# EAGLE schematic Modular_RFPA_v100 (EAGLE 6.6.0)

## Sheet 1 of 3
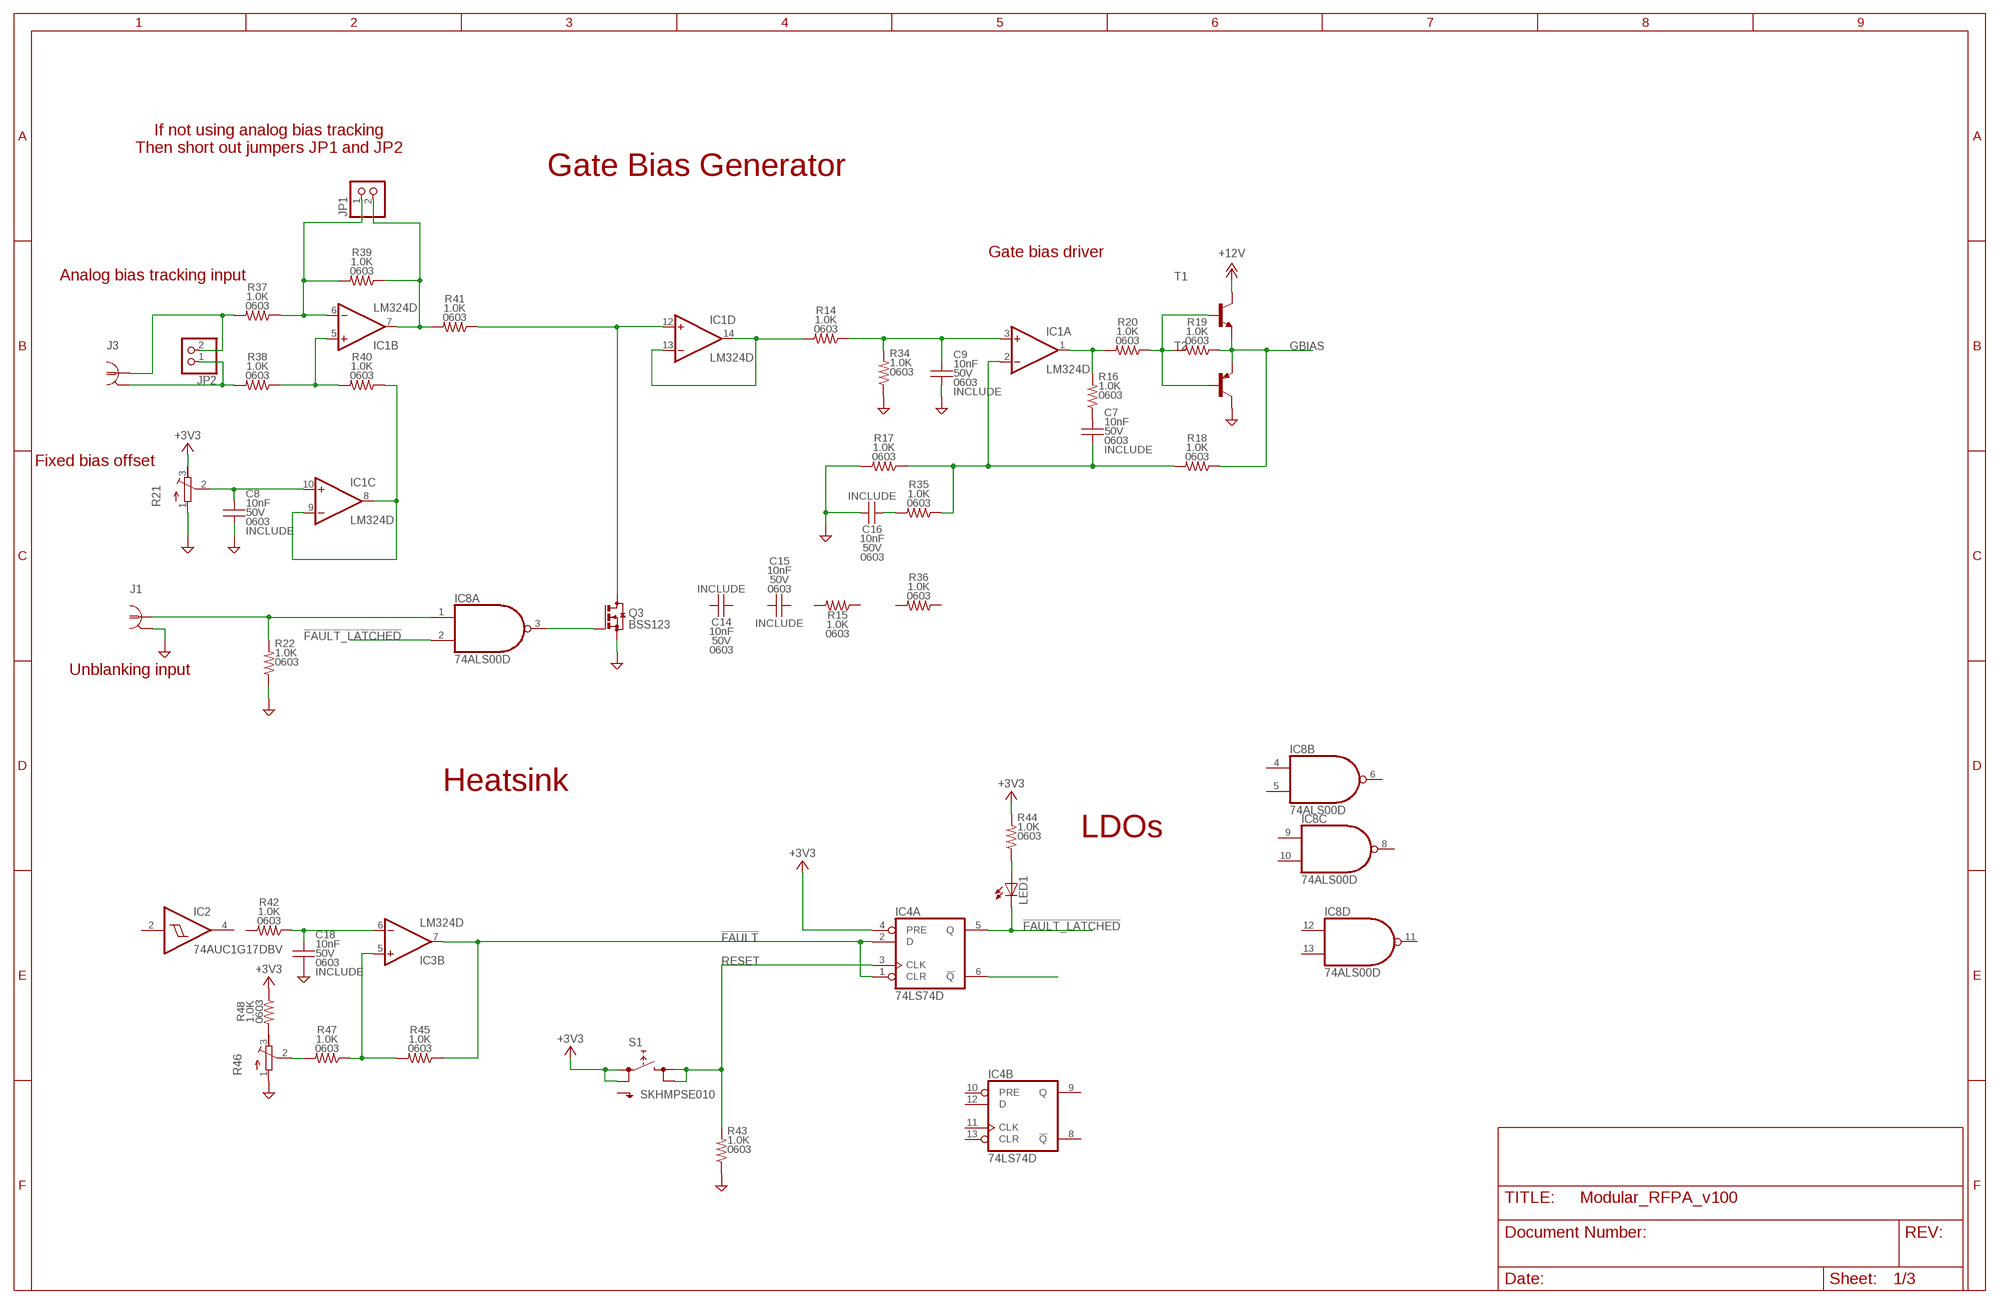
[diagram p0: schematic, sheet 1]

### Parts
C7  10nF  CC-10N-50V-0603-NP00603_IPC  [0603_IPC-7351B]
C8  10nF  CC-10N-50V-0603-NP00603_IPC  [0603_IPC-7351B]
C9  10nF  CC-10N-50V-0603-NP00603_IPC  [0603_IPC-7351B]
C14  10nF  CC-10N-50V-0603-NP00603_IPC  [0603_IPC-7351B]
C15  10nF  CC-10N-50V-0603-NP00603_IPC  [0603_IPC-7351B]
C16  10nF  CC-10N-50V-0603-NP00603_IPC  [0603_IPC-7351B]
C18  10nF  CC-10N-50V-0603-NP00603_IPC  [0603_IPC-7351B]
IC1  LM324D  [SO14]
IC2  74AUC1G17DBV  [SOT23-5]
IC3  LM324D  [SO14]
IC4  74LS74D  [SO14]
IC8  74ALS00D  [SO14]
J1  COAXBNC_EDGE  [BNC_EDGE]
J3  COAXBNC_EDGE  [BNC_EDGE]
JP1  PINHD-1X2  [1X02]
JP2  PINHD-1X2  [1X02]
LED1  LED5MM  [LED5MM]
Q3  BSS123  [SOT23]
R14  1.0K  RR-1.0K-0.1%-0603-0.1W0603_IPC  [0603_IPC-7351B]
R15  1.0K  RR-1.0K-0.1%-0603-0.1W0603_IPC  [0603_IPC-7351B]
R16  1.0K  RR-1.0K-0.1%-0603-0.1W0603_IPC  [0603_IPC-7351B]
R17  1.0K  RR-1.0K-0.1%-0603-0.1W0603_IPC  [0603_IPC-7351B]
R18  1.0K  RR-1.0K-0.1%-0603-0.1W0603_IPC  [0603_IPC-7351B]
R19  1.0K  RR-1.0K-0.1%-0603-0.1W0603_IPC  [0603_IPC-7351B]
R20  1.0K  RR-1.0K-0.1%-0603-0.1W0603_IPC  [0603_IPC-7351B]
R21  R-TRIMM3299W  [RTRIM3299W]
R22  1.0K  RR-1.0K-0.1%-0603-0.1W0603_IPC  [0603_IPC-7351B]
R34  1.0K  RR-1.0K-0.1%-0603-0.1W0603_IPC  [0603_IPC-7351B]
R35  1.0K  RR-1.0K-0.1%-0603-0.1W0603_IPC  [0603_IPC-7351B]
R36  1.0K  RR-1.0K-0.1%-0603-0.1W0603_IPC  [0603_IPC-7351B]
R37  1.0K  RR-1.0K-0.1%-0603-0.1W0603_IPC  [0603_IPC-7351B]
R38  1.0K  RR-1.0K-0.1%-0603-0.1W0603_IPC  [0603_IPC-7351B]
R39  1.0K  RR-1.0K-0.1%-0603-0.1W0603_IPC  [0603_IPC-7351B]
R40  1.0K  RR-1.0K-0.1%-0603-0.1W0603_IPC  [0603_IPC-7351B]
R41  1.0K  RR-1.0K-0.1%-0603-0.1W0603_IPC  [0603_IPC-7351B]
R42  1.0K  RR-1.0K-0.1%-0603-0.1W0603_IPC  [0603_IPC-7351B]
R43  1.0K  RR-1.0K-0.1%-0603-0.1W0603_IPC  [0603_IPC-7351B]
R44  1.0K  RR-1.0K-0.1%-0603-0.1W0603_IPC  [0603_IPC-7351B]
R45  1.0K  RR-1.0K-0.1%-0603-0.1W0603_IPC  [0603_IPC-7351B]
R46  R-TRIMM3299W  [RTRIM3299W]
R47  1.0K  RR-1.0K-0.1%-0603-0.1W0603_IPC  [0603_IPC-7351B]
R48  1.0K  RR-1.0K-0.1%-0603-0.1W0603_IPC  [0603_IPC-7351B]
S1  SKHMPSE010  [SKHMPXE010]
T1  BC808-NPN-SOT23-BEC  [SOT23-BEC]
T2  BC807-16-PNP-SOT23-BEC  [SOT23-BEC]

### Nets
!FAULT: IC3.7(B:OUT) IC4.1(A:CLR) IC4.2(A:D) R45.2
!FAULT_LATCHED: IC4.5(A:Q) IC8.2(A:I1) LED1.K(C)
+3V3: IC4.4(A:PRE) R21.3(E) R44.1 R48.2 S1.1(1.1) S1.2(1.2)
+12V: T1.C ; also sheet 3
GBIAS: R18.2 R19.2 T1.E T2.E ; also sheet 2
GND: C8.2 C9.2 C16.1 C18.2 J1.G1(GND1) J1.G2(GND1) J1.G3(GND1) J1.G4(GND1) Q3.2(S) R17.1 R21.1(A) R22.2 R34.2 R43.2 R46.1(A) T2.C ; also sheet 2,3
N$1: IC1.1(A:OUT) R16.1 R20.1
N$2: R19.1 R20.2 T1.B T2.B
N$3: IC8.1(A:I0) J1.C R22.1
N$6: IC1.13(D:-IN) IC1.14(D:OUT) R14.1
N$7: C7.1 R16.2
N$9: C16.2 R35.1
N$14: C7.2 IC1.2(A:-IN) R17.2 R18.1 R35.2
N$15: C9.1 IC1.3(A:+IN) R14.2 R34.1
N$16: IC1.5(B:+IN) R38.2 R40.1
N$18: IC1.7(B:OUT) JP1.2 R39.2 R41.1
N$19: IC1.6(B:-IN) JP1.1 R37.2 R39.1
N$20: J3.C JP2.2 R37.1
N$21: J3.G1(GND1) J3.G2(GND1) J3.G3(GND1) J3.G4(GND1) JP2.1 R38.1
N$23: IC1.12(D:+IN) Q3.3(D) R41.2
N$24: Q3.1(G)
N$25: C8.1 IC1.10(C:+IN) R21.2(S)
N$26: IC1.8(C:OUT) IC1.9(C:-IN) R40.2
N$27: C18.1 IC3.6(B:-IN) R42.2
N$28: IC4.6(A:!Q)
N$29: LED1.A R44.2
N$31: IC3.5(B:+IN) R45.1 R47.2
N$32: R46.2(S) R47.1
N$33: R46.3(E) R48.1
RESET: IC4.3(A:CLK) R43.1 S1.3(2.1) S1.4(2.2)
Unconnected: C14.1 C14.2 C15.1 C15.2 IC2.2(I) IC2.4(O) IC3.1(A:OUT) IC3.2(A:-IN) IC3.3(A:+IN) IC3.8(C:OUT) IC3.9(C:-IN) IC3.10(C:+IN) IC3.12(D:+IN) IC3.13(D:-IN) IC3.14(D:OUT) IC4.8(B:!Q) IC4.9(B:Q) IC4.10(B:PRE) IC4.11(B:CLK) IC4.12(B:D) IC4.13(B:CLR) IC8.3(A:O) IC8.4(B:I0) IC8.5(B:I1) IC8.6(B:O) IC8.8(C:O) IC8.9(C:I0) IC8.10(C:I1) IC8.11(D:O) IC8.12(D:I0) IC8.13(D:I1) R15.1 R15.2 R36.1 R36.2 R42.1 S1.5(SH)

### Notes on the sheet
- If not using analog bias tracking
  Then short out jumpers JP1 and JP2
- Gate Bias Generator
- Gate bias driver
- Analog bias tracking input
- Fixed bias offset
- Unblanking input
- Heatsink
- LDOs

## Sheet 2 of 3
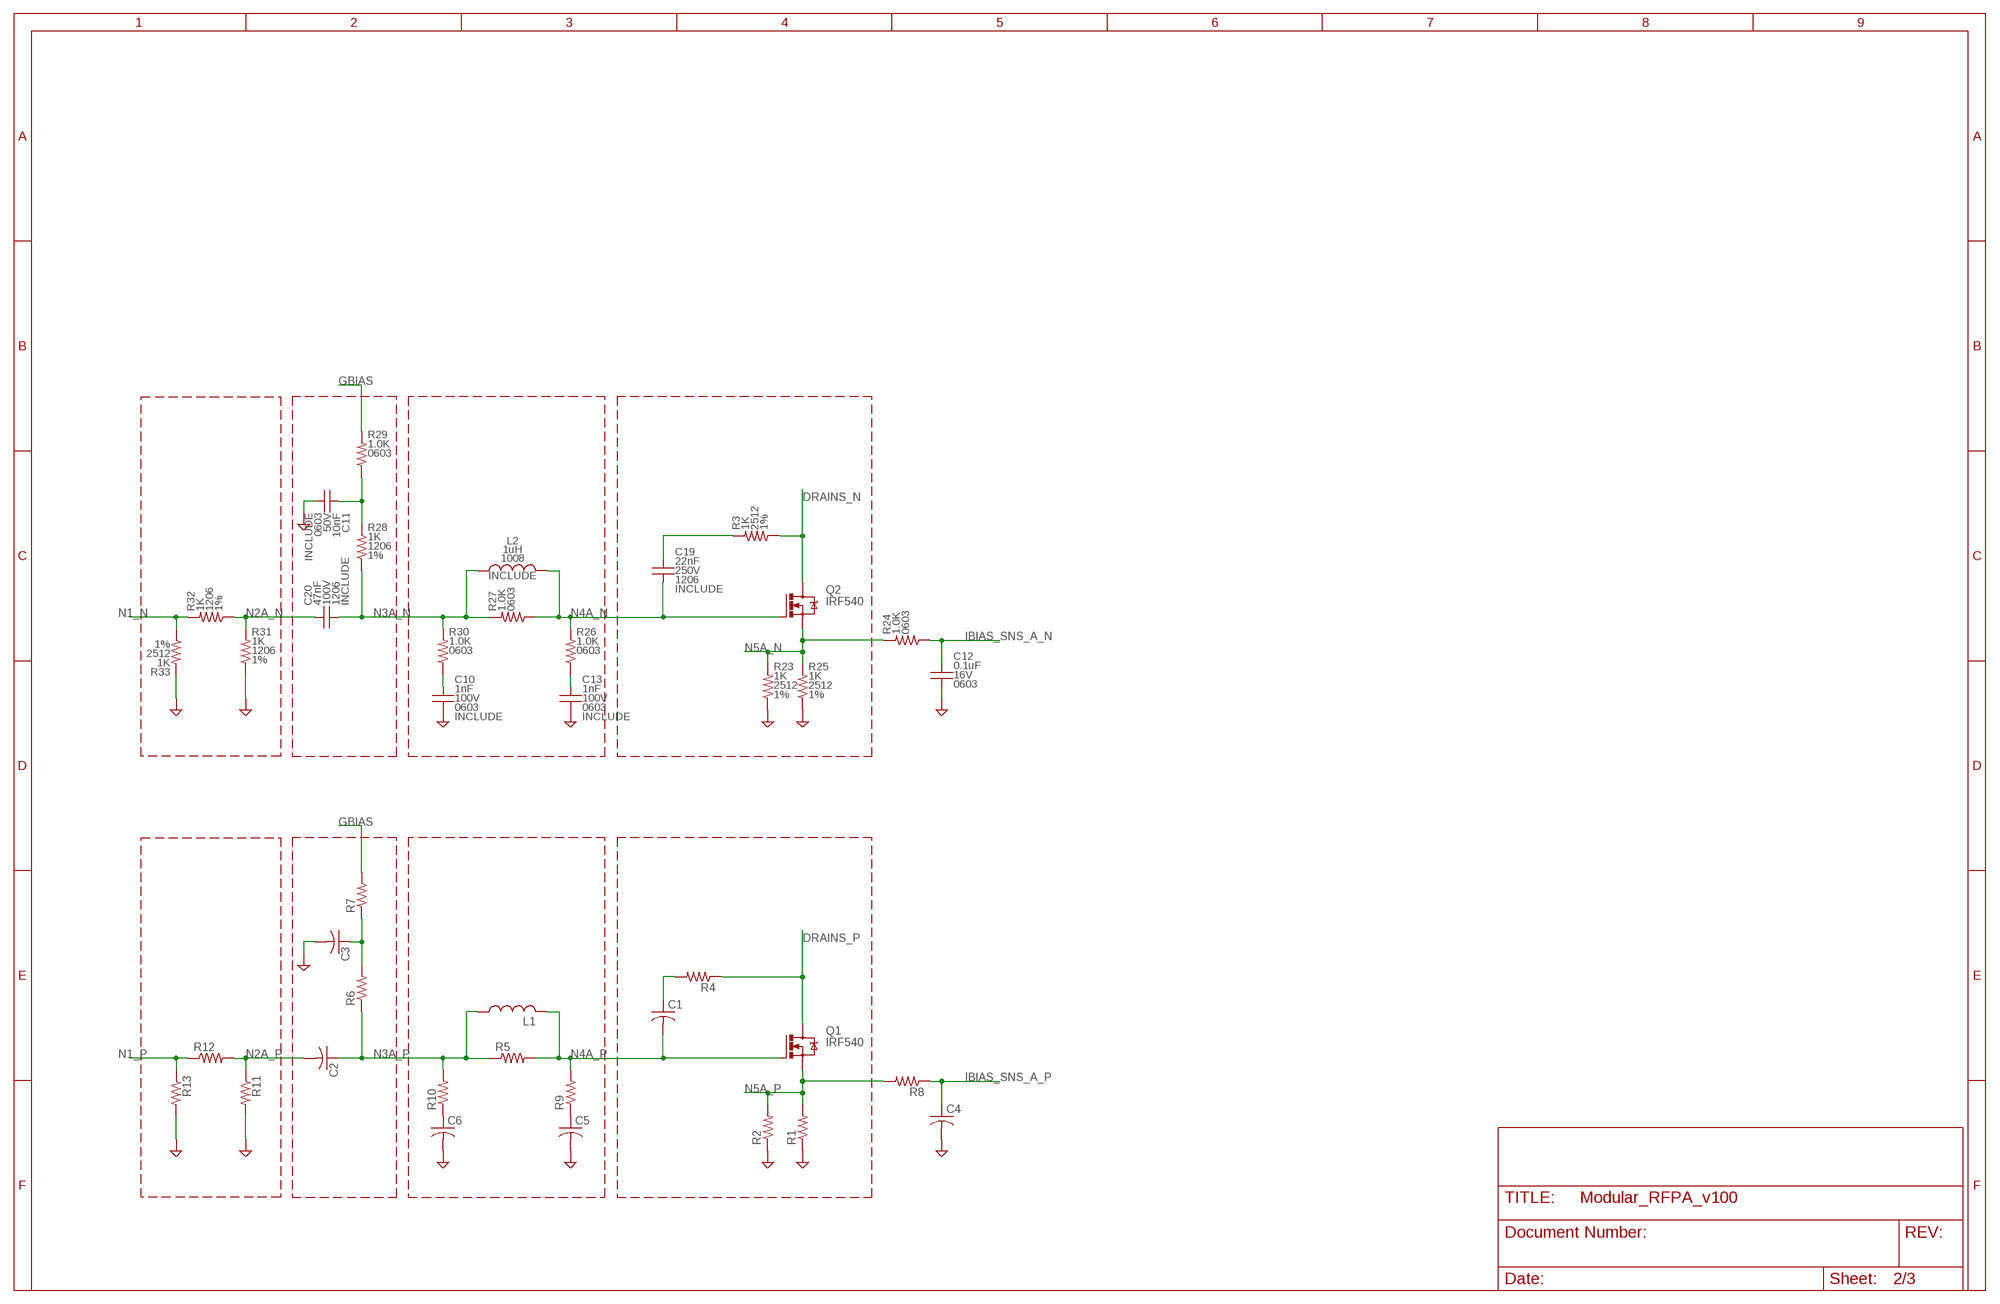
[diagram p1: schematic, sheet 2]

### Parts
C1  C-USC1812  [C1812]
C2  C-USC0805  [C0805]
C3  C-USC0603  [C0603]
C4  C-USC0603  [C0603]
C5  C-USC0603  [C0603]
C6  C-USC0603  [C0603]
C10  1nF  CC-1N-100V-0603-NP00603_IPC  [0603_IPC-7351B]
C11  10nF  CC-10N-50V-0603-NP00603_IPC  [0603_IPC-7351B]
C12  0.1uF  CC-0.1U-16V-0603-X7R0603_IPC  [0603_IPC-7351B]
C13  1nF  CC-1N-100V-0603-NP00603_IPC  [0603_IPC-7351B]
C19  22nF  CC-22N-250V-5%-1206-NP0C1206  [C1206]
C20  47nF  CC-47N-100V-5%-1206-NP0C1206  [C1206]
L1  L-USL1812  [L1812]
L2  1uH  L_CHIPL-1.0U-AIR-5%-1008-0.37A1008  [L1008]
Q1  IRF540  [TO220BV]
Q2  IRF540  [TO220BV]
R1  R-US_R2512  [R2512]
R2  R-US_R2512  [R2512]
R3  1K  RR-1K-1%-2512-1WR2512  [R2512]
R4  R-US_R2512  [R2512]
R5  R-US_R0805  [R0805]
R6  R-US_R0805  [R0805]
R7  R-US_R0603  [R0603]
R8  R-US_R0603  [R0603]
R9  R-US_R0805  [R0805]
R10  R-US_R0805  [R0805]
R11  R-US_R2512  [R2512]
R12  R-US_R2512  [R2512]
R13  R-US_R2512  [R2512]
R23  1K  RR-1K-1%-2512-1WR2512  [R2512]
R24  1.0K  RR-1.0K-0.1%-0603-0.1W0603_IPC  [0603_IPC-7351B]
R25  1K  RR-1K-1%-2512-1WR2512  [R2512]
R26  1.0K  RR-1.0K-0.1%-0603-0.1W0603_IPC  [0603_IPC-7351B]
R27  1.0K  RR-1.0K-0.1%-0603-0.1W0603_IPC  [0603_IPC-7351B]
R28  1K  RR-1.0K-1%-1206-0.25WR1206  [R1206]
R29  1.0K  RR-1.0K-0.1%-0603-0.1W0603_IPC  [0603_IPC-7351B]
R30  1.0K  RR-1.0K-0.1%-0603-0.1W0603_IPC  [0603_IPC-7351B]
R31  1K  RR-1.0K-1%-1206-0.25WR1206  [R1206]
R32  1K  RR-1.0K-1%-1206-0.25WR1206  [R1206]
R33  1K  RR-1K-1%-2512-1WR2512  [R2512]

### Nets
DRAINS_N: Q2.D R3.2
DRAINS_P: Q1.D R4.1
GBIAS: R7.2 R29.1 ; also sheet 1
GND: C3.2 C4.2 C5.2 C6.2 C10.2 C11.2 C12.2 C13.2 R1.1 R2.1 R11.2 R13.2 R23.2 R25.2 R31.2 R33.1 ; also sheet 1,3
IBIAS_SNS_A_N: C12.1 R24.2
IBIAS_SNS_A_P: C4.1 R8.1
N1_N: R32.1 R33.2
N1_P: R12.1 R13.1
N2A_N: C20.1 R31.1 R32.2
N2A_P: C2.2 R11.1 R12.2
N3A_N: C20.2 L2.1 R27.1 R28.2 R30.1
N3A_P: C2.1 L1.1 R5.1 R6.1 R10.2
N4A_N: C19.2 L2.2 Q2.G R26.1 R27.2
N4A_P: C1.2 L1.2 Q1.G R5.2 R9.2
N5A_N: Q2.S R23.1 R24.1 R25.1
N5A_P: Q1.S R1.2 R2.2 R8.2
N$4: C1.1 R4.2
N$5: C10.1 R30.2
N$8: C3.1 R6.2 R7.1
N$10: C19.1 R3.1
N$11: C5.1 R9.1
N$12: C6.1 R10.1
N$13: C11.1 R28.1 R29.2
N$17: C13.1 R26.2

## Sheet 3 of 3: Power entry
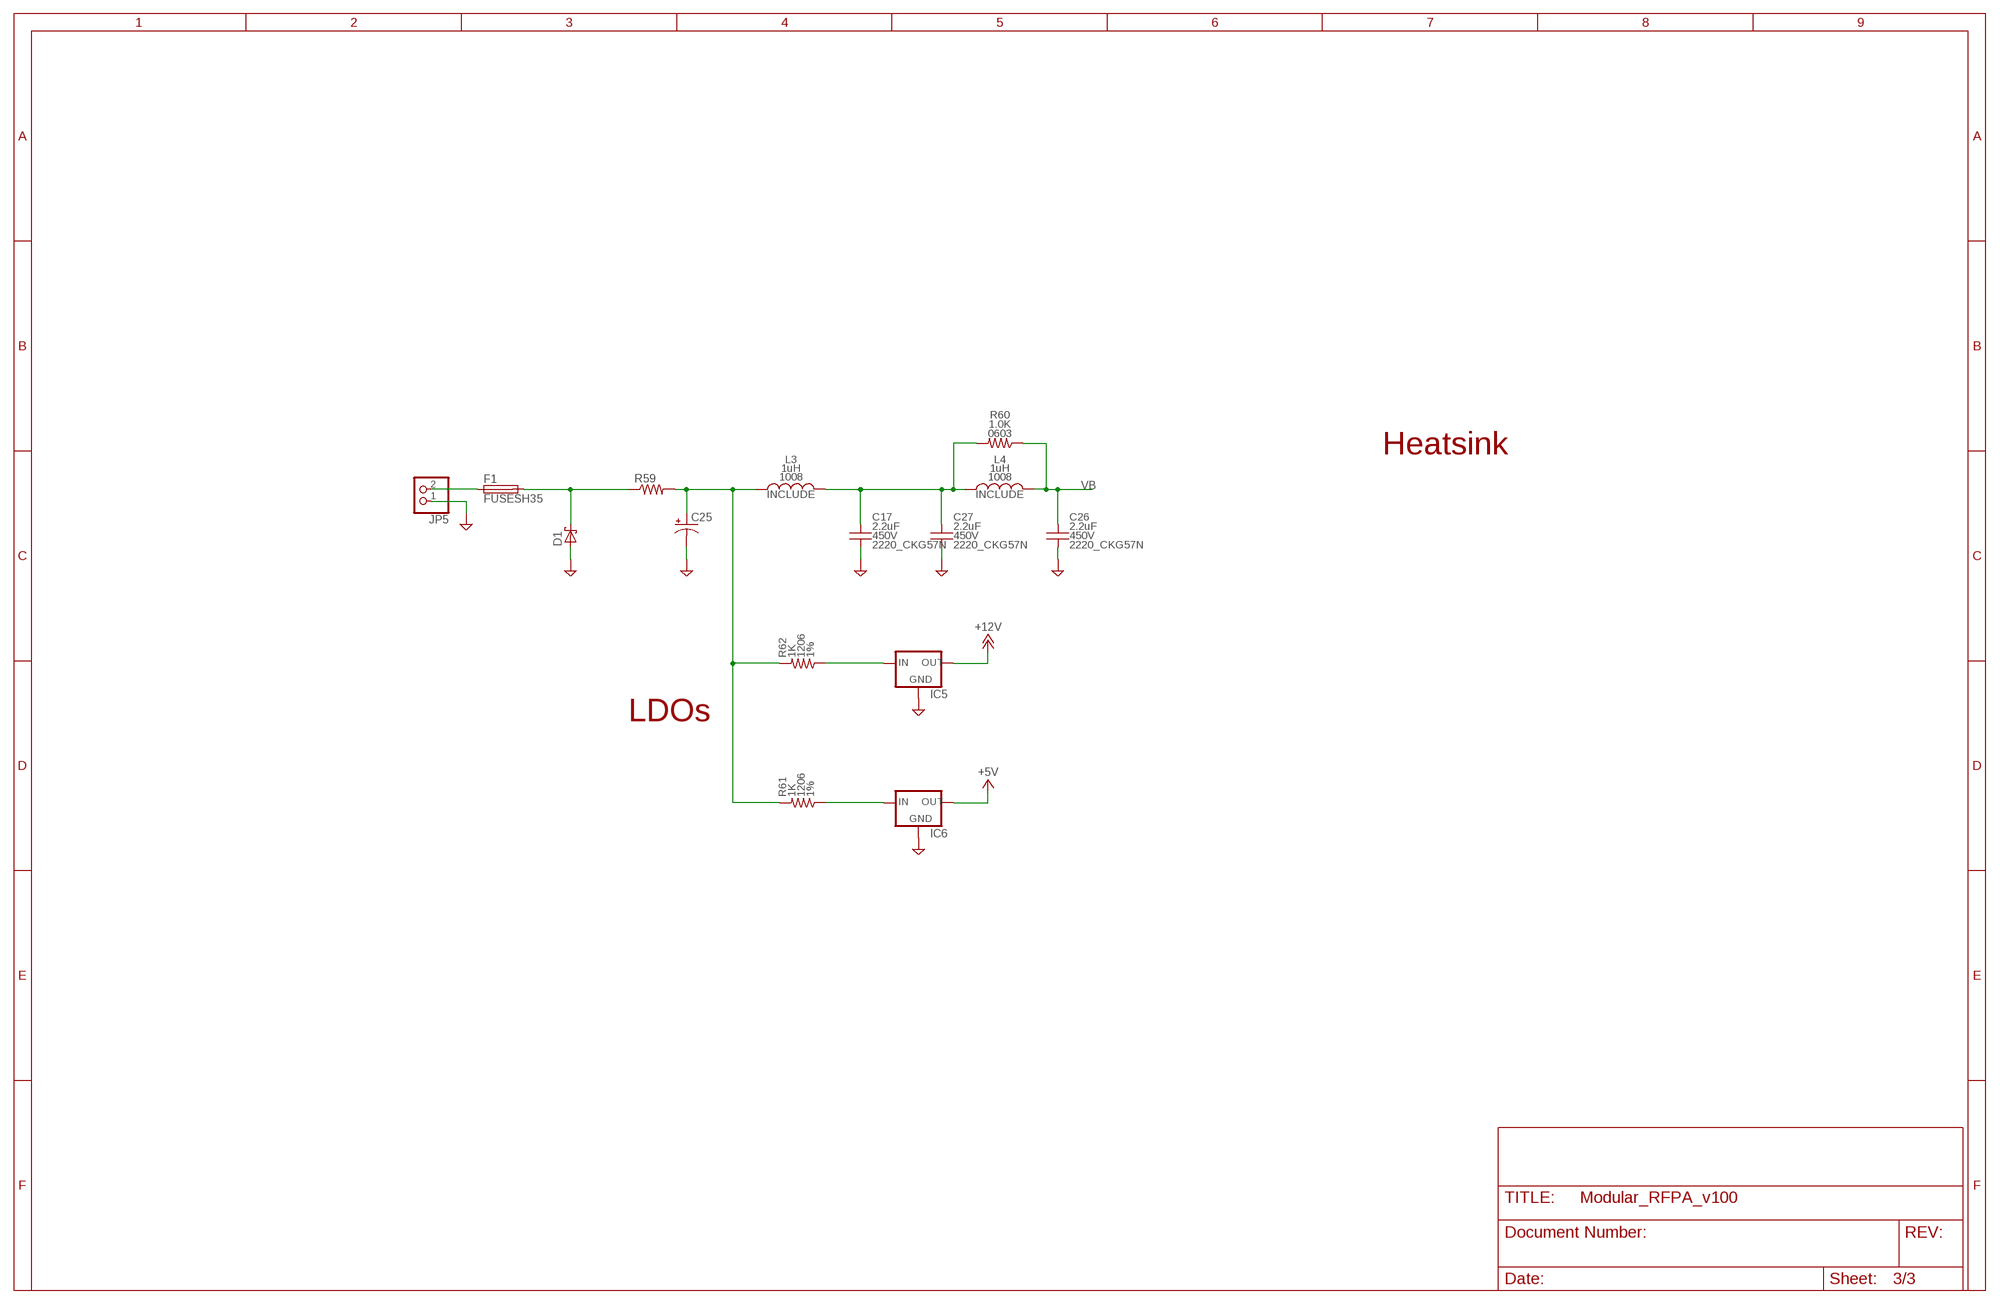
[diagram p2: schematic, sheet 3]

### Parts
C17  2.2uF  CC-2.2U-450V-20%-2220-X7TC2220_CKG57N  [C2220_CKG57N]
C25  CPOL-USE10-25  [EB25D]
C26  2.2uF  CC-2.2U-450V-20%-2220-X7TC2220_CKG57N  [C2220_CKG57N]
C27  2.2uF  CC-2.2U-450V-20%-2220-X7TC2220_CKG57N  [C2220_CKG57N]
D1  SCHOTTKY-DIODESMC  [SMC]
F1  FUSESH35  [SH25]
IC5  78XXS  [78XXS]
IC6  78XXS  [78XXS]
JP5  PINHD-1X2  [1X02]
L3  1uH  L_CHIPL-1.0U-AIR-5%-1008-0.37A1008  [L1008]
L4  1uH  L_CHIPL-1.0U-AIR-5%-1008-0.37A1008  [L1008]
R59  R-US_0617/22  [0617/22]
R60  1.0K  RR-1.0K-0.1%-0603-0.1W0603_IPC  [0603_IPC-7351B]
R61  1K  RR-1.0K-1%-1206-0.25WR1206  [R1206]
R62  1K  RR-1.0K-1%-1206-0.25WR1206  [R1206]

### Nets
+5V: IC6.OUT
+12V: IC5.OUT ; also sheet 1
GND: C17.2 C25.- C26.2 C27.2 D1.A IC5.GND IC6.GND JP5.1 ; also sheet 1,2
N$43: IC5.IN R62.2
N$44: D1.C F1.2 R59.1
N$45: F1.1 JP5.2
N$46: C25.+ L3.1 R59.2 R61.1 R62.1
N$47: C17.1 C27.1 L3.2 L4.1 R60.1
N$49: IC6.IN R61.2
VB: C26.1 L4.2 R60.2

### Notes on the sheet
- Heatsink
- LDOs

## Power pins joined to a net without a drawn wire
GND: IC2.3(GND) IC4.7(P:GND) IC8.7(P:GND)
V+: IC1.4(P:V+) IC3.4(P:V+)
V-: IC1.11(P:V-) IC3.11(P:V-)
VCC: IC2.5(VCC) IC4.14(P:VCC) IC8.14(P:VCC)

## Library data of the parts
C1-C6 = rcl:C-US: CAPACITOR, American symbol
C7-C9 C11 C14-C16 C18 = MDT_C:C; BOM: INCLUDE; DIALECTRIC: NP0; PACKAGE: 0603; PARTNO: C1608C0G1H103J080AA; TOL: 5; VOLTAGE: 50V
C10 C13 = MDT_C:C; BOM: INCLUDE; DIALECTRIC: NP0; PACKAGE: 0603; PARTNO: C1608C0G2A102J080AA; TOL: 5; VOLTAGE: 100V
C12 = MDT_C:C; PACKAGE: 0603; VOLTAGE: 16V
C17 C26 C27 = MDT_C:C; DIALECTRIC: X7T; PACKAGE: 2220_CKG57N; PARTNO: CKG57NX7T2W225M500JJ; TOL: 20%; VOLTAGE: 450V
C19 = MDT_C:C; BOM: INCLUDE; DIALECTRIC: NP0; PACKAGE: 1206; PARTNO: C3216NP02E223J160AA; TOL: 5; VOLTAGE: 250V
C20 = MDT_C:C; BOM: INCLUDE; DIALECTRIC: NP0; PACKAGE: 1206; PARTNO: C3216C0G2A473J115AC; TOL: 5; VOLTAGE: 100V
C25 = rcl:CPOL-US: POLARIZED CAPACITOR, American symbol
D1 = diode:SCHOTTKY-DIODE: Schottky Diode
F1 = fuse:FUSE: Fuse; OC_FARNELL: unknown; OC_NEWARK: unknown
IC1 IC3 = linear:LM324: OP AMP
IC2 = 74xx-little-us:74*1G17: Single Schmitt-Trigger Buffer
IC4 = 74xx-us:74*74: Dual D type positive edge triggered FLIP FLOP, preset and clear
IC5 IC6 = v-reg:78XXS: VOLTAGE REGULATOR
IC8 = 74xx-us:74*00: Quad 2-input NAND gate
J1 J3 = MDT_CON:COAX
JP1 JP2 JP5 = pinhead:PINHD-1X2: PIN HEADER
L1 = rcl:L-US: INDUCTOR, American symbol
L2-L4 = MDT_L:L_CHIP; BOM: INCLUDE; CORE: AIR; DCR: 1.8; IDC: 0.37A; PACKAGE: 1008; PARTNO: 1008CS-102XJEC; TOL: 5%
LED1 = led:LED: LED OSRAM: - CHIPLED LG R971, LG N971, LY N971, LG Q971, LY Q971, LO R971, LY R971 LH N974, LH R974 LS Q976, LO Q976, LY Q976 LO Q996 - Hyper CHIPLED LW Q18S LB Q993, LB Q99A, LB R99A - SideLED LS A670, LO A670, LY A670, LG A670, LP A670 LB A673, LV A673, LT A673, LW A673 LH A674 LY A675 LS A676, LA A676, LO A676, LY A676, LW A676 LS A679, LY A679, LG A679 - Hyper Micro SIDELED® LS Y876, LA Y876, LO Y876, LY Y876 LT Y87S - SmartLED LW L88C, LW L88S LB L89C, LB L89S, LG L890 LS L89K, LO L89K, LY L89K LS L896, LA L896, LO L896, LY L896 - TOPLED LS T670, LO T670, LY T670, LG T670, LP T670 LSG T670, LSP T670, LSY T670, LOP T670, LYG T670 LG T671, LOG T671, LSG T671 LB T673, LV T673, LT T673, LW T673 LH T674 LS T676, LA T676, LO T676, LY T676, LB T676, LH T676, LSB T676, LW T676 LB T67C, LV T67C, LT T67C, LS T67K, LO T67K, LY T67K, LW E67C LS E67B, LA E67B, LO E67B, LY E67B, LB E67C, LV E67C, LT E67C LW T67C LS T679, LY T679, LG T679 LS T770, LO T770, LY T770, LG T770, LP T770 LB T773, LV T773, LT T773, LW T773 LH T774 LS E675, LA E675, LY E675, LS T675 LS T776, LA T776, LO T776, LY T776, LB T776 LHGB T686 LT T68C, LB T68C - Hyper Mini TOPLED® LB M676 - Mini TOPLED Santana® LG M470 LS M47K, LO M47K, LY M47K Source: http://www.osram.convergy.de LUXEON: - LUMILED® LXK2-PW12-R00, LXK2-PW12-S00, LXK2-PW14-U00, LXK2-PW14-V00 LXK2-PM12-R00, LXK2-PM12-S00, LXK2-PM14-U00 LXK2-PE12-Q00, LXK2-PE12-R00, LXK2-PE12-S00, LXK2-PE14-T00, LXK2-PE14-U00 LXK2-PB12-K00, LXK2-PB12-L00, LXK2-PB12-M00, LXK2-PB14-N00, LXK2-PB14-P00, LXK2-PB14-Q00 LXK2-PR12-L00, LXK2-PR12-M00, LXK2-PR14-Q00, LXK2-PR14-R00 LXK2-PD12-Q00, LXK2-PD12-R00, LXK2-PD12-S00 LXK2-PH12-R00, LXK2-PH12-S00 LXK2-PL12-P00, LXK2-PL12-Q00, LXK2-PL12-R00 Source: www.luxeon.com KINGBRIGHT: KA-3528ASYC Source: www.kingbright.com
Q1 Q2 = transistor-power:IRF540: HEXFET Power MOSFET
Q3 = transistor-small-signal:BSS123: N-CHANNEL MOS FET
R1 R2 R4-R13 = rcl:R-US_: RESISTOR, American symbol
R3 R23 R25 R33 = MDT_R:R; PACKAGE: 2512; POWER: 1; TOL: 1%
R14-R20 R22 R24 R26 R27 R29 R30 R34-R45 R47 R48 R60 = MDT_R:R; PACKAGE: 0603
R21 R46 = rcl:R-TRIMM: Trimm resistor
R28 R31 R32 R61 R62 = MDT_R:R; PACKAGE: 1206; POWER: 0.25; TOL: 1%
R59 = resistor:R-US_: RESISTOR, American symbol
S1 = switch:SKHMP*E010: 6.2 X 6.5mm TACT Switch (SMD) Source: http://www3.alps.co.jp/WebObjects/catalog.woa/PDF/E/Switch/Tact/SKHM/SKHM.PDF
T1 = transistor:*-NPN-: NPN Transistror BF959 corrected 2008.03.06
T2 = transistor:*-PNP-: PNP Transistror